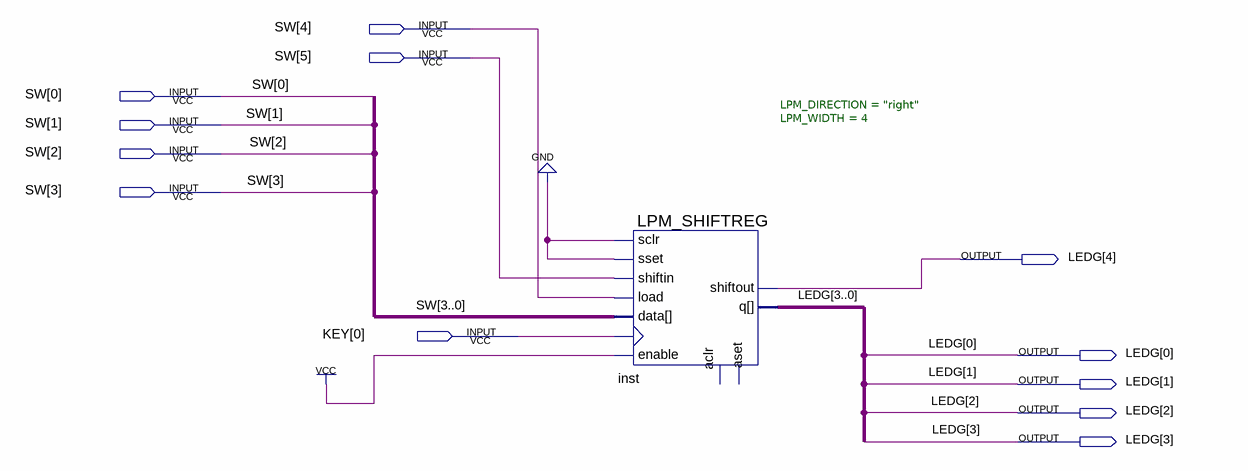
[diagram p0: schematic sheet]
// Quartus schematic SHIFTREGTEST.bdf as structural Verilog: 1 symbols, 12 pins
module SHIFTREGTEST (
  input  [5:0] SW,
  input  [0:0] KEY,
  output [4:0] LEDG
);

  LPM_SHIFTREG #(.LPM_DIRECTION("right"), .LPM_WIDTH(4)) inst (
    .shiftin(SW[5]), .sset(1'b0), .enable(1'b1), .clock(KEY[0]), .data(SW[3:0]), .load(SW[4]), .sclr(1'b0),
    .shiftout(LEDG[4]), .q(LEDG[3:0]));  // open: aset, aclr
endmodule
